# EAGLE design adapter_clear (EAGLE 5.04)
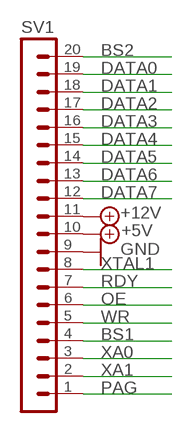
[diagram p0: schematic, sheet 1]

## Parts
SV1  MA20-1  [MA20-1]

## Nets
+5V: SV1.10
+12V: SV1.11
BS1: SV1.4
BS2: SV1.20
DATA0: SV1.19
DATA1: SV1.18
DATA2: SV1.17
DATA3: SV1.16
DATA4: SV1.15
DATA5: SV1.14
DATA6: SV1.13
DATA7: SV1.12
GND: SV1.9
OE: SV1.6
PAG: SV1.1
RDY: SV1.7
WR: SV1.5
XA0: SV1.3
XA1: SV1.2
XTAL1: SV1.8

## Library data of the parts
SV1 = con-lstb:MA20-1: PIN HEADER

## Board
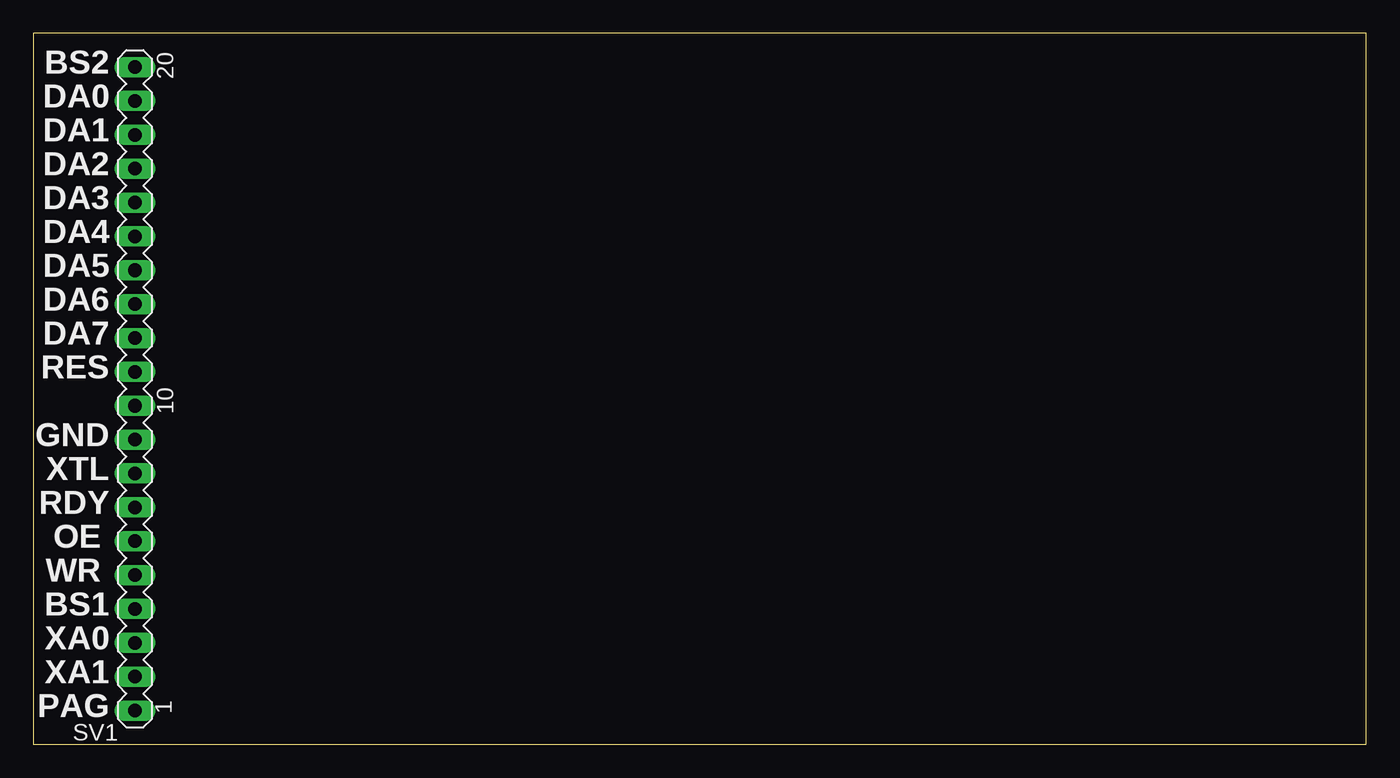
[diagram p1: board, top side]
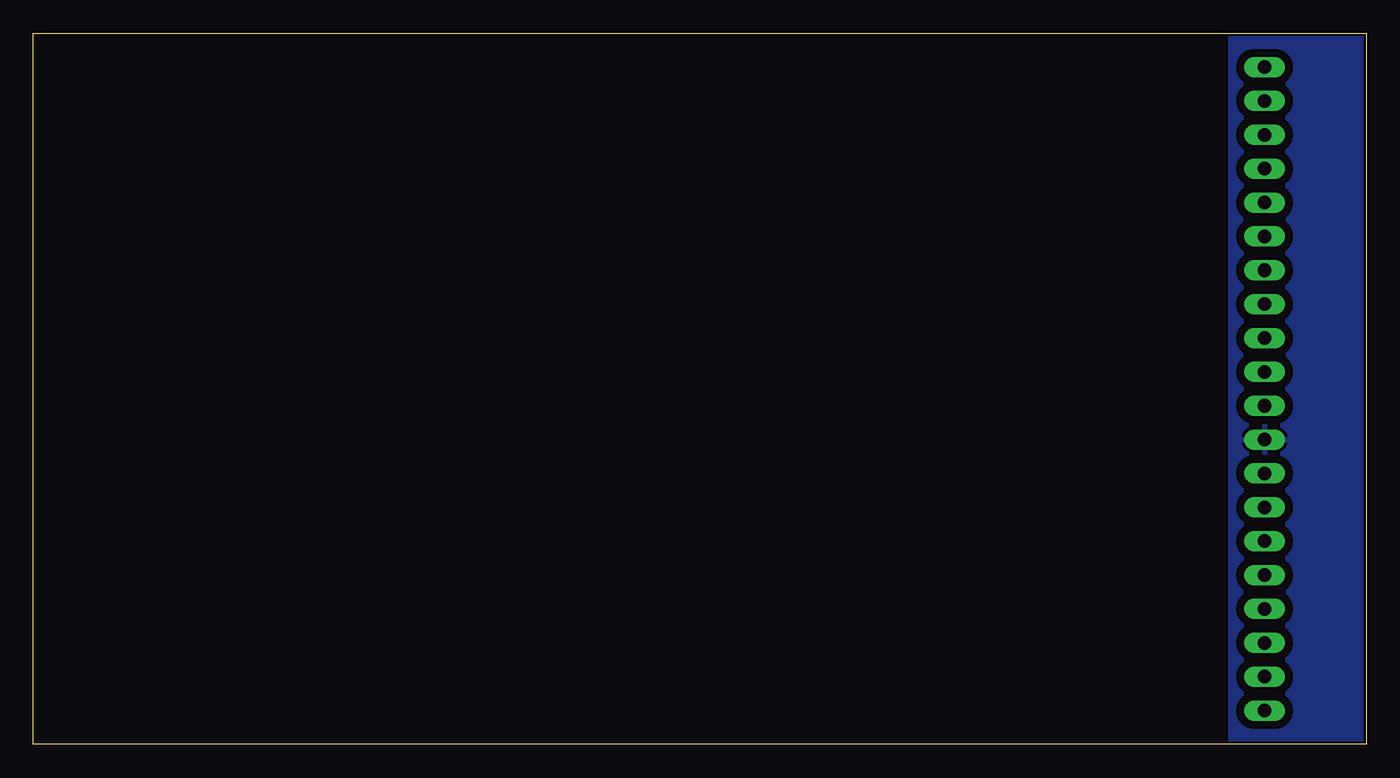
[diagram p2: board, bottom side, seen from below]

Size 100 x 53.33 mm. Coordinates in mm from the lower left corner, seen from the top.
Outline: 0,0 100,0 100,53.33 0,53.33 0,0
Copper layers (1*16): Top 0.035mm / dielectric 1.5mm / Bottom 0.035mm
Design rules "default *": minimum track width 10mil, minimum drill 24mil, track to track 24mil, track to pad 24mil, pad to pad 8mil, via to via 8mil, smd to smd 8mil, copper to edge 8mil, drill to drill 8mil, minimum pad ring 10mil, minimum via ring 8mil, stop-mask expansion 4mil, vias tented up to drill 0mil, thermal gap 10mil

### Footprints (pad centres in the part's own frame; a part is rotated, then mirrored left to right if it is on the bottom)
MA20-1 = drill 1.016 long: 1 -24.13,0; 2 -21.59,0; 3 -19.05,0; 4 -16.51,0; 5 -13.97,0; 6 -11.43,0; 7 -8.89,0; 8 -6.35,0; 9 -3.81,0; 10 -1.27,0; 11 1.27,0; 12 3.81,0; 13 6.35,0; 14 8.89,0; 15 11.43,0; 16 13.97,0; 17 16.51,0; 18 19.05,0; 19 21.59,0; 20 24.13,0

### Placement (x,y rotation side)
SV1  7.62,26.67 90 top

### Tracks (layer width: path | path; a pad name or v marks a point on that pad's centre or on a via)
GND
  pour Bottom: 0,53.34 10.16,53.34 10.16,0 0,0

### Text on the board
tPlace: BS2 | DA0 | DA1 | DA2 | DA3 | DA4 | DA5 | DA6 | DA7 | RES | GND | XTL | RDY | OE | WR | BS1 | XA0 | XA1 | PAG